# EAGLE board discferret_main (EAGLE 6.6.0)
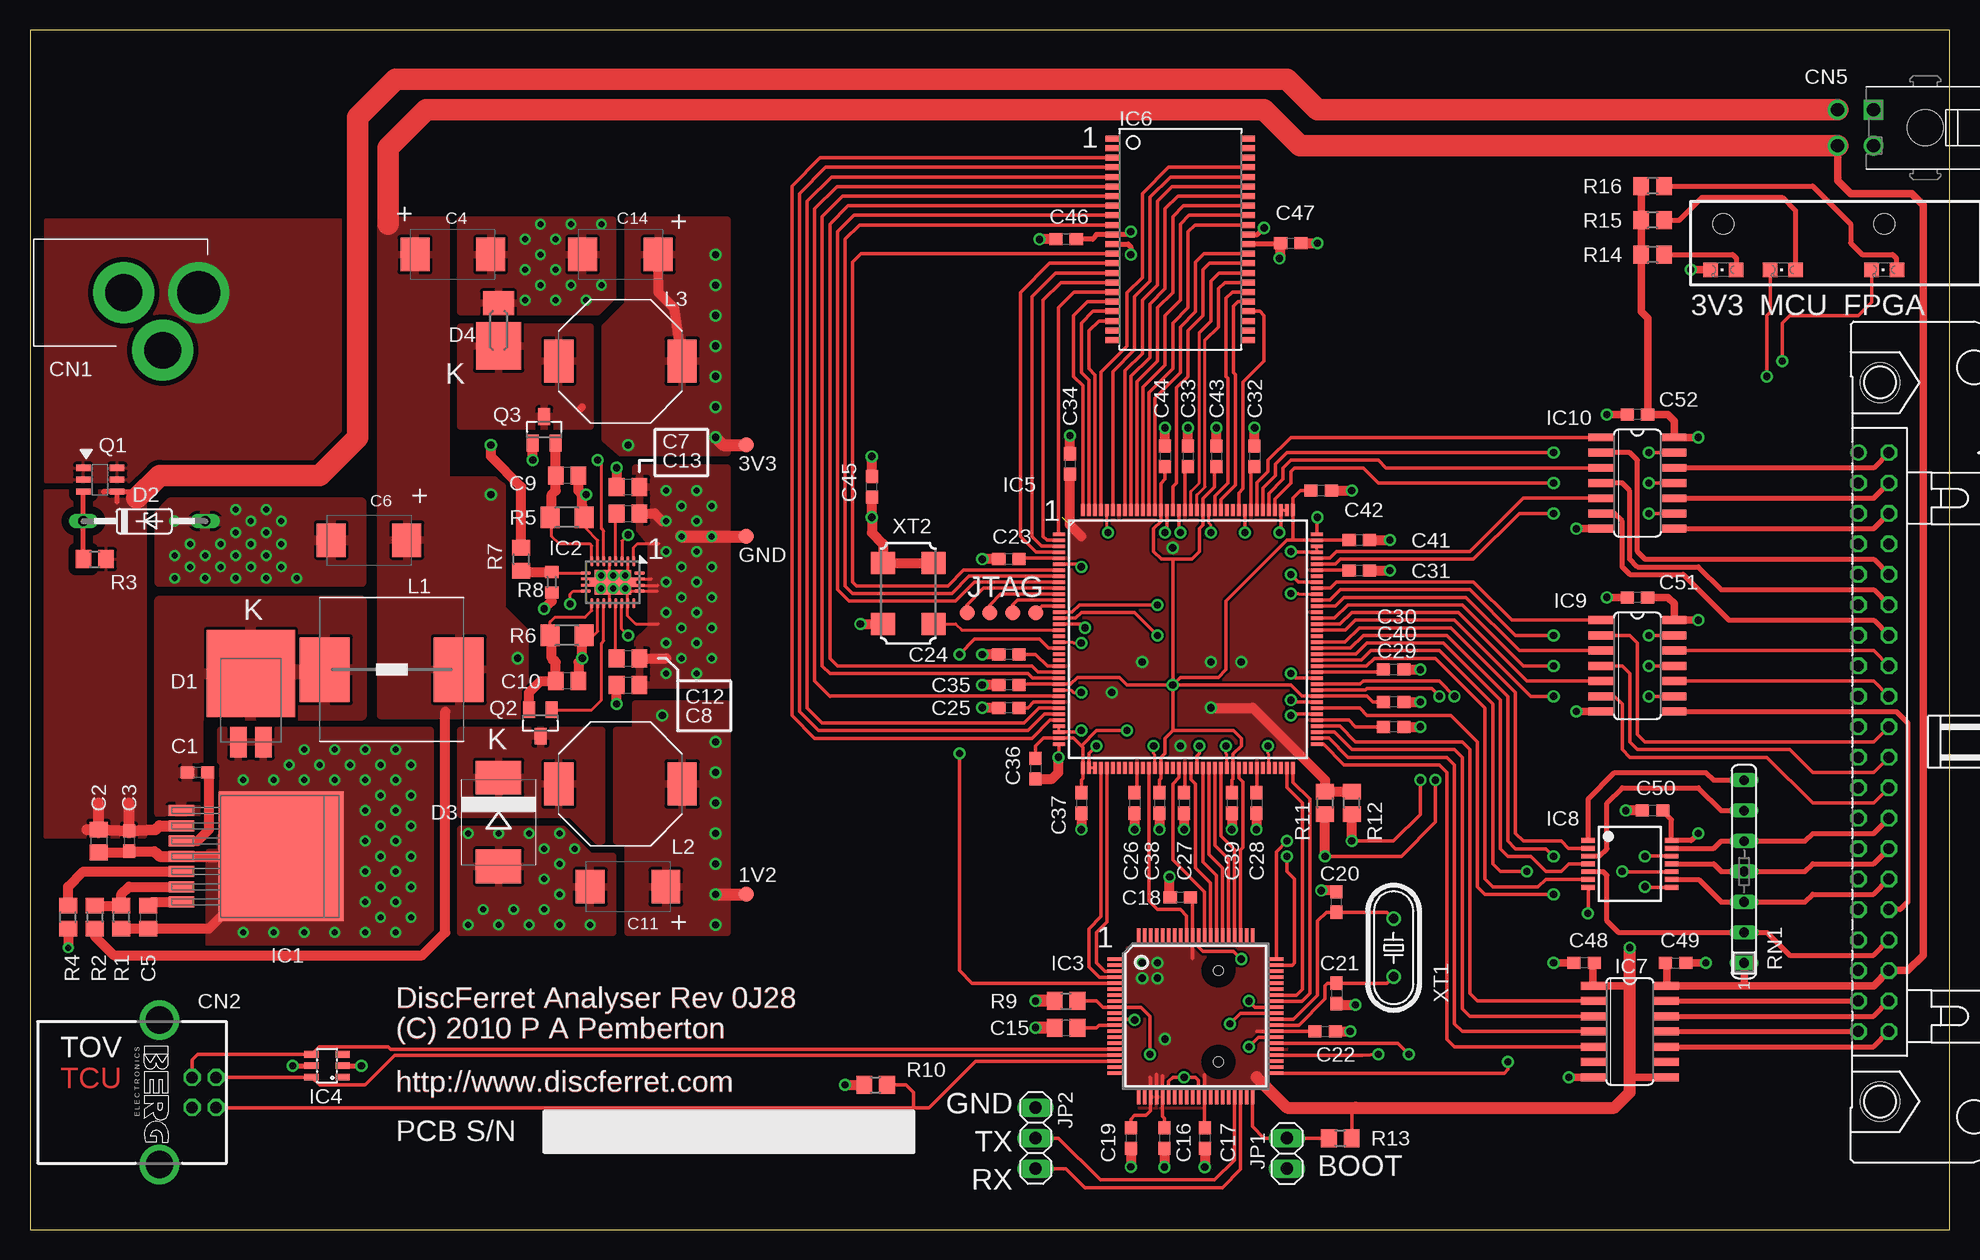
[diagram p8: board, top side]
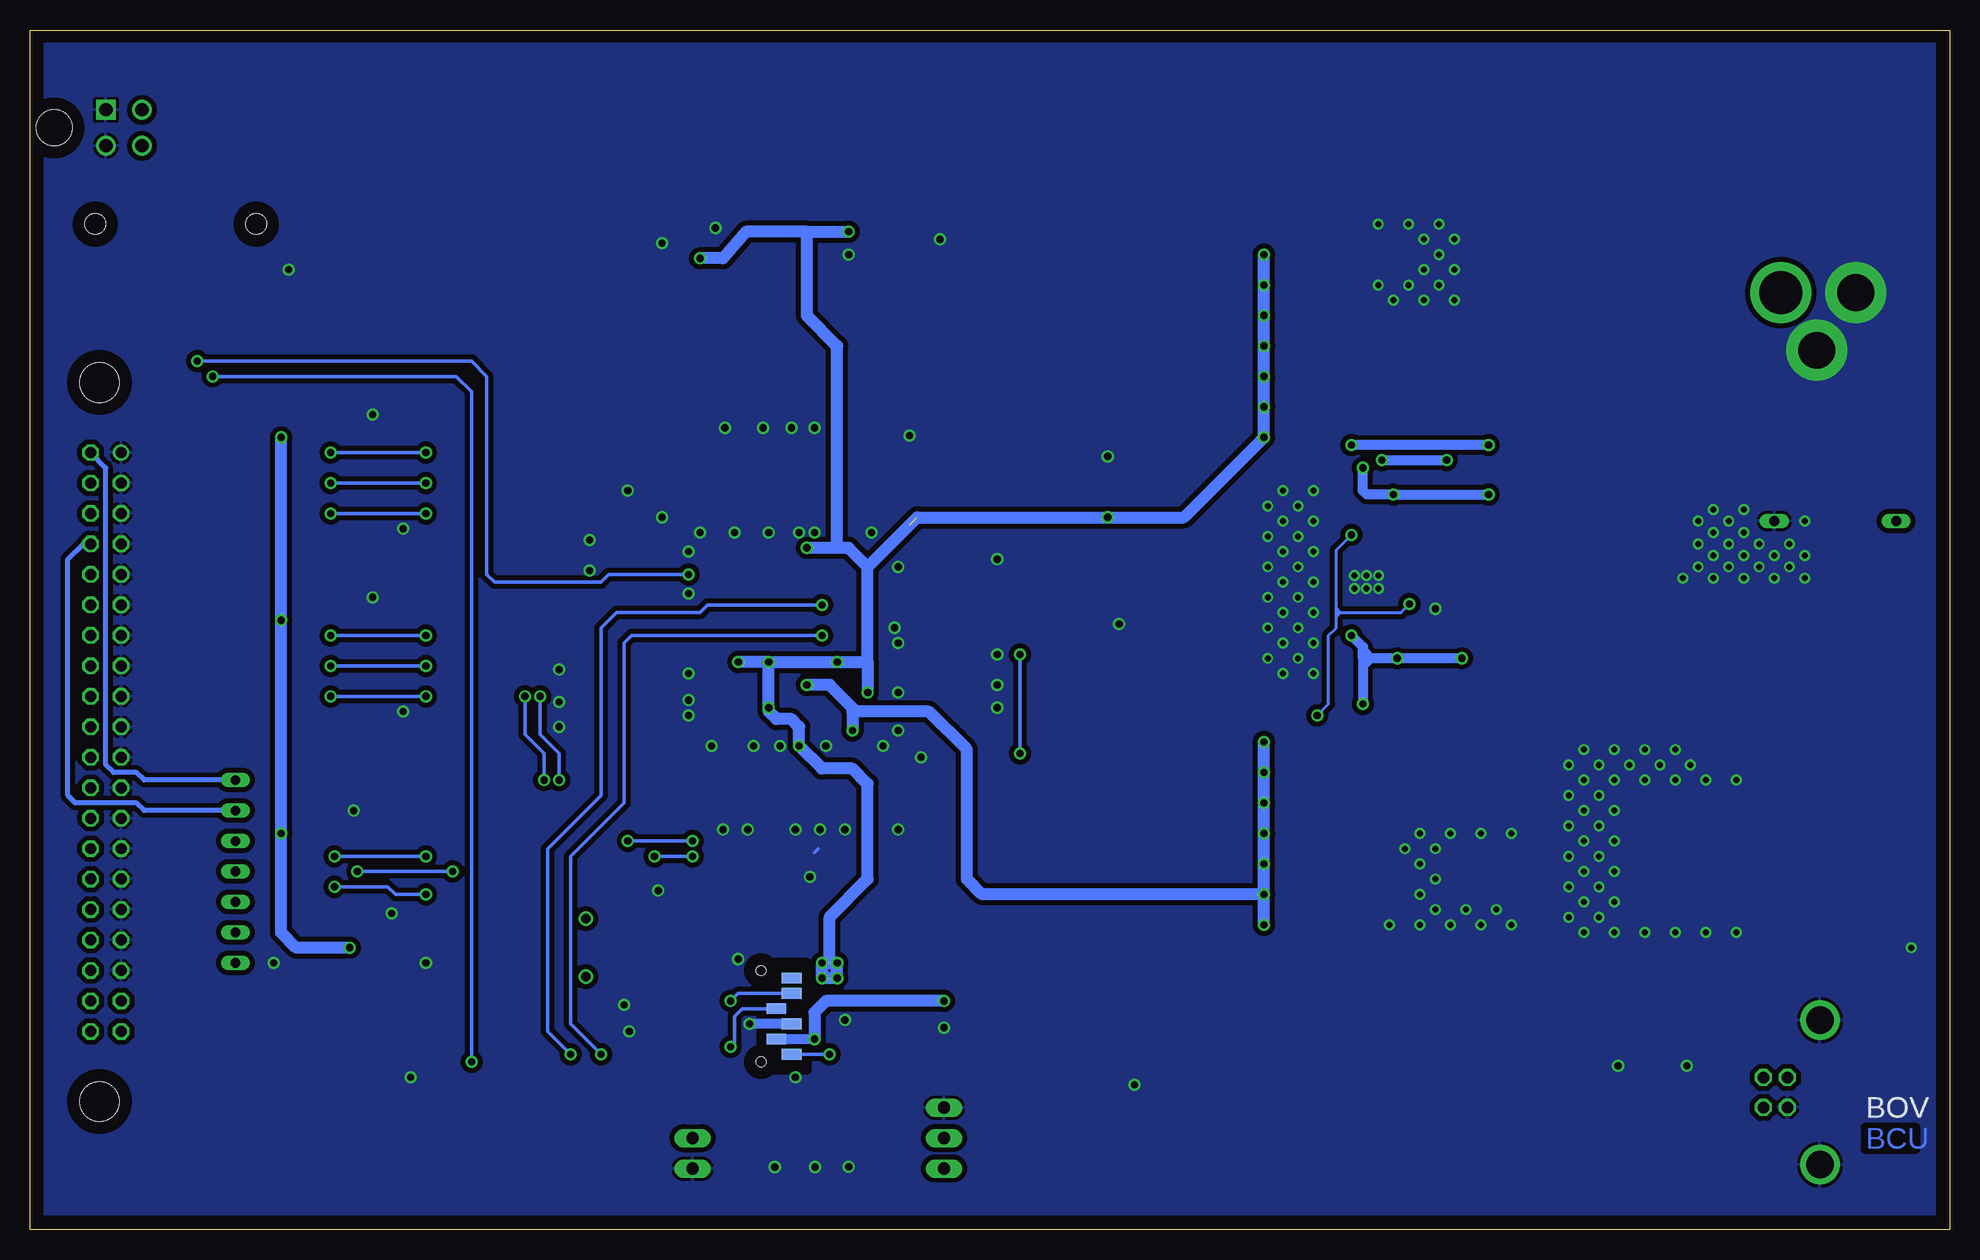
[diagram p9: board, bottom side, seen from below]

Size 160 x 100 mm. Coordinates in mm from the lower left corner, seen from the top.
Outline: 0,0 160,0 160,100 0,100 0,0
Copper layers (1*16): Top 0.035mm / dielectric 1.5mm / Bottom 0.035mm
Design rules "default *": minimum track width 6mil, minimum drill 12mil, track to track 7mil, track to pad 7mil, pad to pad 7mil, via to via 7mil, smd to smd 7mil, copper to edge 40mil, drill to drill 20mil, minimum pad ring 8mil, minimum via ring 8mil, stop-mask expansion 6mil, vias tented up to drill 0mil, thermal gap 10mil
Holes 1.7 mm at 154.56,83.82 141.15,83.82
tKeepout: area 0,97.5 to 160,100; area 0,0 to 160,2.5

## Footprints (pad centres in the part's own frame; a part is rotated, then mirrored left to right if it is on the bottom)
B1,27 = smd 1.27 x 1.27: TP 0,0
C0603 = smd 1.1 x 1: 1 -0.85,0; 2 0.85,0
C0805 = smd 1.3 x 1.5: 1 -0.95,0; 2 0.95,0
SMC_D = smd 2.4 x 2.8: + -3.15,0; - 3.15,0
RAPC722NT = drill 3.048 pad 5.08: BARREL 0,7.493; SW 4.801,10.744 | drill 3.556 pad 5.08: PIN 0,13.741
PN61729-S = drill 0.95 octagon: 1 1.25,4.71; 2 -1.25,4.71; 3 -1.25,2.71; 4 1.25,2.71 | drill 2.3 pad 2.9: S1 -6.02,0; S2 6.02,0
ICSP_SMD = smd 1.651 x 0.889: 1 -0.635,3.175; 2 0.635,1.905; 3 -0.635,0.635; 4 0.635,-0.635; 5 -0.635,-1.905; 6 -0.635,-3.175 | hole 0.8: 1.905,3.81; 1.905,-3.81
40H = drill 0.914: 1 -24.13,-1.27 | drill 0.914 octagon: 2 -24.13,1.27; 3 -21.59,-1.27; 4 -21.59,1.27; 5 -19.05,-1.27; 6 -19.05,1.27; 7 -16.51,-1.27; 8 -16.51,1.27; 9 -13.97,-1.27; 10 -13.97,1.27; 11 -11.43,-1.27; 12 -11.43,1.27; 13 -8.89,-1.27; 14 -8.89,1.27; 15 -6.35,-1.27; 16 -6.35,1.27; 17 -3.81,-1.27; 18 -3.81,1.27; 19 -1.27,-1.27; 20 -1.27,1.27; 21 1.27,-1.27; 22 1.27,1.27; 23 3.81,-1.27; 24 3.81,1.27; 25 6.35,-1.27; 26 6.35,1.27; 27 8.89,-1.27; 28 8.89,1.27; 29 11.43,-1.27; 30 11.43,1.27; 31 13.97,-1.27; 32 13.97,1.27; 33 16.51,-1.27; 34 16.51,1.27; 35 19.05,-1.27; 36 19.05,1.27; 37 21.59,-1.27; 38 21.59,1.27; 39 24.13,-1.27; 40 24.13,1.27 | hole 3.302: -29.972,0.533; 29.972,0.533
3-794618-4 = drill 1.1 square: 1 0,0 | drill 1.1: 2 0,3; 3 -3,0; 4 -3,3 | hole 3: -1.5,-4.32
TO277A_SMPC_LARGEPAD = smd 1.397 x 2.54: 1 1.041,-4.445; 2 -1.041,-4.445 | smd 7.341 x 7.264: K 0,1.27
DO35Z10 = drill 0.813 long: A 5.08,0; C -5.08,0
SMC = smd 2.8 x 3.8: A 3.7,0; C -3.7,0
POWERMITE_LARGEPAD = smd 3.97 x 3.77: 1 -1.27,0 | smd 1.97 x 2.57: 2 2.3,0
TO263-7 = smd 2.159 x 0.914: 1 8.331,-3.81; 2 8.331,-2.54; 3 8.331,-1.27; 4 8.331,0; 5 8.331,1.27; 6 8.331,2.54; 7 8.331,3.81 | smd 10.414 x 10.795: PAD 0,0
R-PQFP-N20 = smd 0.85 x 0.28: 1 -2.235,-0.75; 10 2.235,-0.75; 11 2.235,0.75; 20 -2.235,0.75 | smd 0.28 x 0.85: 2 -1.75,-1.75; 3 -1.25,-1.75; 4 -0.75,-1.75; 5 -0.25,-1.75; 6 0.25,-1.75; 7 0.75,-1.75; 8 1.25,-1.75; 9 1.75,-1.75; 12 1.75,1.75; 13 1.25,1.75; 14 0.75,1.75; 15 0.25,1.75; 16 -0.25,1.75; 17 -0.75,1.75; 18 -1.25,1.75; 19 -1.75,1.75 | smd 3.05 x 2.05: E@1 0,0 | smd 3.85 x 0.5: E@2 0,0 | smd 5.3 x 0.23: E@3 0,0.275; E@4 0,-0.275
TQFP80-12X12 = smd 1.2 x 0.3: 1 -6.725,4.75; 2 -6.725,4.25; 3 -6.725,3.75; 4 -6.725,3.25; 5 -6.725,2.75; 6 -6.725,2.25; 7 -6.725,1.75; 8 -6.725,1.25; 9 -6.725,0.75; 10 -6.725,0.25; 11 -6.725,-0.25; 12 -6.725,-0.75; 13 -6.725,-1.25; 14 -6.725,-1.75; 15 -6.725,-2.25; 16 -6.725,-2.75; 17 -6.725,-3.25; 18 -6.725,-3.75; 19 -6.725,-4.25; 20 -6.725,-4.75; 41 6.725,-4.75; 42 6.725,-4.25; 43 6.725,-3.75; 44 6.725,-3.25; 45 6.725,-2.75; 46 6.725,-2.25; 47 6.725,-1.75; 48 6.725,-1.25; 49 6.725,-0.75; 50 6.725,-0.25; 51 6.725,0.25; 52 6.725,0.75; 53 6.725,1.25; 54 6.725,1.75; 55 6.725,2.25; 56 6.725,2.75; 57 6.725,3.25; 58 6.725,3.75; 59 6.725,4.25; 60 6.725,4.75 | smd 0.3 x 1.2: 21 -4.75,-6.725; 22 -4.25,-6.725; 23 -3.75,-6.725; 24 -3.25,-6.725; 25 -2.75,-6.725; 26 -2.25,-6.725; 27 -1.75,-6.725; 28 -1.25,-6.725; 29 -0.75,-6.725; 30 -0.25,-6.725; 31 0.25,-6.725; 32 0.75,-6.725; 33 1.25,-6.725; 34 1.75,-6.725; 35 2.25,-6.725; 36 2.75,-6.725; 37 3.25,-6.725; 38 3.75,-6.725; 39 4.25,-6.725; 40 4.75,-6.725; 61 4.75,6.725; 62 4.25,6.725; 63 3.75,6.725; 64 3.25,6.725; 65 2.75,6.725; 66 2.25,6.725; 67 1.75,6.725; 68 1.25,6.725; 69 0.75,6.725; 70 0.25,6.725; 71 -0.25,6.725; 72 -0.75,6.725; 73 -1.25,6.725; 74 -1.75,6.725; 75 -2.25,6.725; 76 -2.75,6.725; 77 -3.25,6.725; 78 -3.75,6.725; 79 -4.25,6.725; 80 -4.75,6.725
SOT23-6L = smd 0.55 x 1.2: 1 -0.95,-1.3; 2 0,-1.3; 3 0.95,-1.3; 4 0.95,1.3; 5 0,1.3; 6 -0.95,1.3
TQFP144 = smd 1 x 0.3: 1 -10.75,8.75; 2 -10.75,8.25; 3 -10.75,7.75; 4 -10.75,7.25; 5 -10.75,6.75; 6 -10.75,6.25; 7 -10.75,5.75; 8 -10.75,5.25; 9 -10.75,4.75; 10 -10.75,4.25; 11 -10.75,3.75; 12 -10.75,3.25; 13 -10.75,2.75; 14 -10.75,2.25; 15 -10.75,1.75; 16 -10.75,1.25; 17 -10.75,0.75; 18 -10.75,0.25; 19 -10.75,-0.25; 20 -10.75,-0.75; 21 -10.75,-1.25; 22 -10.75,-1.75; 23 -10.75,-2.25; 24 -10.75,-2.75; 25 -10.75,-3.25; 26 -10.75,-3.75; 27 -10.75,-4.25; 28 -10.75,-4.75; 29 -10.75,-5.25; 30 -10.75,-5.75; 31 -10.75,-6.25; 32 -10.75,-6.75; 33 -10.75,-7.25; 34 -10.75,-7.75; 35 -10.75,-8.25; 36 -10.75,-8.75; 73 10.75,-8.75; 74 10.75,-8.25; 75 10.75,-7.75; 76 10.75,-7.25; 77 10.75,-6.75; 78 10.75,-6.25; 79 10.75,-5.75; 80 10.75,-5.25; 81 10.75,-4.75; 82 10.75,-4.25; 83 10.75,-3.75; 84 10.75,-3.25; 85 10.75,-2.75; 86 10.75,-2.25; 87 10.75,-1.75; 88 10.75,-1.25; 89 10.75,-0.75; 90 10.75,-0.25; 91 10.75,0.25; 92 10.75,0.75; 93 10.75,1.25; 94 10.75,1.75; 95 10.75,2.25; 96 10.75,2.75; 97 10.75,3.25; 98 10.75,3.75; 99 10.75,4.25; 100 10.75,4.75; 101 10.75,5.25; 102 10.75,5.75; 103 10.75,6.25; 104 10.75,6.75; 105 10.75,7.25; 106 10.75,7.75; 107 10.75,8.25; 108 10.75,8.75 | smd 0.3 x 1: 37 -8.75,-10.75; 38 -8.25,-10.75; 39 -7.75,-10.75; 40 -7.25,-10.75; 41 -6.75,-10.75; 42 -6.25,-10.75; 43 -5.75,-10.75; 44 -5.25,-10.75; 45 -4.75,-10.75; 46 -4.25,-10.75; 47 -3.75,-10.75; 48 -3.25,-10.75; 49 -2.75,-10.75; 50 -2.25,-10.75; 51 -1.75,-10.75; 52 -1.25,-10.75; 53 -0.75,-10.75; 54 -0.25,-10.75; 55 0.25,-10.75; 56 0.75,-10.75; 57 1.25,-10.75; 58 1.75,-10.75; 59 2.25,-10.75; 60 2.75,-10.75; 61 3.25,-10.75; 62 3.75,-10.75; 63 4.25,-10.75; 64 4.75,-10.75; 65 5.25,-10.75; 66 5.75,-10.75; 67 6.25,-10.75; 68 6.75,-10.75; 69 7.25,-10.75; 70 7.75,-10.75; 71 8.25,-10.75; 72 8.75,-10.75; 109 8.75,10.75; 110 8.25,10.75; 111 7.75,10.75; 112 7.25,10.75; 113 6.75,10.75; 114 6.25,10.75; 115 5.75,10.75; 116 5.25,10.75; 117 4.75,10.75; 118 4.25,10.75; 119 3.75,10.75; 120 3.25,10.75; 121 2.75,10.75; 122 2.25,10.75; 123 1.75,10.75; 124 1.25,10.75; 125 0.75,10.75; 126 0.25,10.75; 127 -0.25,10.75; 128 -0.75,10.75; 129 -1.25,10.75; 130 -1.75,10.75; 131 -2.25,10.75; 132 -2.75,10.75; 133 -3.25,10.75; 134 -3.75,10.75; 135 -4.25,10.75; 136 -4.75,10.75; 137 -5.25,10.75; 138 -5.75,10.75; 139 -6.25,10.75; 140 -6.75,10.75; 141 -7.25,10.75; 142 -7.75,10.75; 143 -8.25,10.75; 144 -8.75,10.75
TSOPII-Z44 = smd 0.5 x 1.2: 1 -8.4,-5.627; 2 -7.6,-5.627; 3 -6.8,-5.627; 4 -6,-5.627; 5 -5.2,-5.627; 6 -4.4,-5.627; 7 -3.6,-5.627; 8 -2.8,-5.627; 9 -2,-5.627; 10 -1.2,-5.627; 11 -0.4,-5.627; 12 0.4,-5.627; 13 1.2,-5.627; 14 2,-5.627; 15 2.8,-5.627; 16 3.6,-5.627; 17 4.4,-5.627; 18 5.2,-5.627; 19 6,-5.627; 20 6.8,-5.627; 21 7.6,-5.627; 22 8.4,-5.627; 23 8.4,5.627; 24 7.6,5.627; 25 6.8,5.627; 26 6,5.627; 27 5.2,5.627; 28 4.4,5.627; 29 3.6,5.627; 30 2.8,5.627; 31 2,5.627; 32 1.2,5.627; 33 0.4,5.627; 34 -0.4,5.627; 35 -1.2,5.627; 36 -2,5.627; 37 -2.8,5.627; 38 -3.6,5.627; 39 -4.4,5.627; 40 -5.2,5.627; 41 -6,5.627; 42 -6.8,5.627; 43 -7.6,5.627; 44 -8.4,5.627
SO14 = smd 0.66 x 2.032: 1 -3.81,-3.073; 2 -2.54,-3.073; 3 -1.27,-3.073; 4 0,-3.073; 5 1.27,-3.073; 6 2.54,-3.073; 7 3.81,-3.073; 8 3.81,3.073; 9 2.54,3.073; 10 1.27,3.073; 11 0,3.073; 12 -1.27,3.073; 13 -2.54,3.073; 14 -3.81,3.073
SSOP14 = smd 0.4 x 1.1: 1 -1.95,-3.475; 2 -1.3,-3.475; 3 -0.65,-3.475; 4 0,-3.475; 5 0.65,-3.475; 6 1.3,-3.475; 7 1.95,-3.475; 8 1.95,3.475; 9 1.3,3.475; 10 0.65,3.475; 11 0,3.475; 12 -0.65,3.475; 13 -1.3,3.475; 14 -1.95,3.475
1X02 = drill 1.016 long: 1 -1.27,0; 2 1.27,0
1X03 = drill 1.016 long: 1 -2.54,0; 2 0,0; 3 2.54,0
WE-PD_L/LS/XL/XXL = smd 4.17 x 5.4: 1 -5.585,0; 2 5.585,0
WE-TPC_XL/XLH = smd 3.6 x 2.435: 1 0,5.135; 2 0,-5.135
CHIPLED_0805 = smd 1.2 x 1.2: A 0,-1.05; C 0,1.05
TSOP6_VISHAY_LARGEPAD = smd 0.508 x 1.219: 1 0,0; 2 0.991,0; 3 1.981,0; 4 1.981,2.819; 5 0.991,2.819; 6 0,2.819
SOT23 = smd 1 x 1.4: 1 -0.95,-1.1; 2 0.95,-1.1; 3 0,1.1
R0805 = smd 1.3 x 1.5: 1 -0.95,0; 2 0.95,0
R1206 = smd 1.6 x 1.803: 1 -1.422,0; 2 1.422,0
R0603 = smd 1 x 1.1: 1 -0.85,0; 2 0.85,0
SIL7 = drill 0.813 long: 1 -7.62,0; 2 -5.08,0; 3 -2.54,0; 4 0,0; 5 2.54,0; 6 5.08,0; 7 7.62,0
HC49/S = drill 0.813: 1 -2.413,0; 2 2.413,0
CSX750F = smd 1.8 x 2: 1 0,0; 2 5.08,0; 3 5.08,4.2; 4 0,4.2

## Placement (x,y rotation side)
1V2  TPB1,27  [B1,27]  59.69,27.94 0 top
3V3  TPB1,27  [B1,27]  59.69,65.41 0 top
C1  10n  [C0603]  13.97,38.1 180 top
C2  10u  [C0805]  5.71,32.38 270 top
C3  100n  [C0603]  8.26,32.38 270 top
C4  100u 10V  [SMC_D]  35.24,81.28 0 top
C5  2n7  [C0805]  9.84,26.04 270 top
C6  100u  [SMC_D]  28.26,57.47 180 top
C7  100n  [C0805]  49.85,61.91 0 top
C8  100n  [C0805]  49.85,45.4 0 top
C9  10u  [C0805]  44.77,62.87 180 top
C10  10u  [C0805]  44.77,45.72 180 top
C11  100u 10V  [SMC_D]  49.85,28.57 180 top
C12  1n5  [C0805]  49.85,47.62 0 top
C13  1n5  [C0805]  49.85,59.69 0 top
C14  100u 10V  [SMC_D]  49.21,81.28 180 top
C15  10u  [C0805]  86.36,16.83 0 top
C16  100n  [C0603]  94.55,7.62 270 top
C17  100n  [C0603]  97.92,7.62 270 top
C18  100n  [C0603]  95.89,27.69 180 top
C19  100n  [C0603]  91.76,7.62 270 top
C20  12p  [C0603]  108.9,27.3 90 top
C21  12p  [C0603]  108.9,19.68 270 top
C22  100n  [C0603]  107.95,16.51 0 top
C23  10n  [C0603]  81.6,55.88 180 top
C24  10n  [C0603]  81.6,47.94 180 top
C25  10n  [C0603]  81.6,43.5 180 top
C26  10n  [C0603]  92.08,35.56 270 top
C27  10n  [C0603]  96.2,35.56 270 top
C28  10n  [C0603]  102.23,35.56 270 top
C29  10n  [C0603]  113.67,41.91 180 top
C30  10n  [C0603]  113.67,46.67 180 top
C31  10n  [C0603]  110.81,54.93 180 top
C32  10n  [C0603]  102.08,64.45 270 top
C33  10n  [C0603]  96.52,64.45 270 top
C34  10n  [C0603]  86.68,63.82 270 top
C35  10n  [C0603]  81.6,45.4 180 top
C36  10n  [C0603]  83.82,38.42 270 top
C37  10n  [C0603]  87.63,35.56 270 top
C38  10n  [C0603]  94.14,35.56 270 top
C39  10n  [C0603]  100.17,35.56 270 top
C40  10n  [C0603]  113.67,43.97 180 top
C41  10n  [C0603]  110.81,57.47 180 top
C42  10n  [C0603]  107.63,61.59 180 top
C43  10n  [C0603]  98.9,64.45 270 top
C44  10n  [C0603]  94.62,64.45 270 top
C45  10n  [C0603]  70.17,61.91 90 top
C46  10n  [C0603]  86.36,82.55 180 top
C47  10n  [C0603]  105.09,82.23 0 top
C48  10n  [C0603]  129.54,22.23 180 top
C49  10n  [C0603]  137.16,22.23 0 top
C50  10n  [C0603]  135.25,34.92 180 top
C51  10n  [C0603]  133.99,52.7 180 top
C52  10n  [C0603]  133.99,67.94 180 top
CN1  RAPC722  [RAPC722NT]  0.32,78.11 270 top
CN2  PN61729-S  [PN61729-S]  10.79,11.43 270 top
CN3  ICSPSMD  [ICSP_SMD]  97.16,17.78 180 bottom
CN4  [40H]  153.67,40.64 270 top
CN5  2X2-A  [3-794618-4]  153.67,93.34 90 top
D1  SS8P3L-M3/86A  [TO277A_SMPC_LARGEPAD]  18.41,45.09 0 top
D2  BZX55 7V5  [DO35Z10]  9.53,59.05 0 top
D3  SS32  [SMC]  39.05,33.97 270 top
D4  MBRM120LT  [POWERMITE_LARGEPAD]  39.05,74.93 90 top
GND  TPB1,27  [B1,27]  59.69,57.78 0 top
IC1  LM2679S  [TO263-7]  20.95,31.11 180 top
IC2  TPS75003  [R-PQFP-N20]  48.58,53.98 180 top
IC3  PIC18F85J50  [TQFP80-12X12]  97.16,17.78 0 top
IC4  SN65220  [SOT23-6L]  24.77,13.65 90 top
IC5  EP2C8AT144  [TQFP144]  96.52,49.21 0 top
IC6  CY7C1049DV33  [TSOPII-Z44]  95.89,82.55 270 top
IC7  TXB0104D  [SO14]  133.35,16.51 270 top
IC8  SN74LVC14ADB  [SSOP14]  133.35,30.48 270 top
IC9  SN74LVC07AD  [SO14]  133.99,46.99 270 top
IC10  SN74LVC07AD  [SO14]  133.99,62.23 270 top
JP1  BOOT  [1X02]  104.78,6.35 90 top
JP2  UART  [1X03]  83.82,7.62 270 top
L1  10uH  [WE-PD_L/LS/XL/XXL]  30.16,46.67 0 top
L2  15uH  [WE-TPC_XL/XLH]  49.21,37.15 90 top
L3  5uH  [WE-TPC_XL/XLH]  49.21,72.39 90 top
LED1  GRN 0805  [CHIPLED_0805]  141.15,80.01 90 top
LED2  YLW 0805  [CHIPLED_0805]  146.1,80.01 90 top
LED3  YLW 0805  [CHIPLED_0805]  154.56,80.01 90 top
Q1  SI3443CDV  [TSOP6_VISHAY_LARGEPAD]  4.45,63.5 270 top
Q2  SI2323DS-T1-E3  [SOT23]  42.55,42.23 180 top
Q3  SI2323DS-T1-E3  [SOT23]  42.86,66.67 0 top
R1  2k49  [R0805]  7.62,26.04 90 top
R2  7k87  [R0805]  5.4,26.04 270 top
R3  1k5  [R0805]  5.4,55.88 0 top
R4  4k99  [R0805]  3.17,26.04 90 top
R5  0R033  [R1206]  44.77,59.37 0 top
R6  0R033  [R1206]  44.77,49.53 0 top
R7  61k9  [R0805]  40.96,55.88 90 top
R8  36k5  [R0603]  43.5,53.98 90 top
R9  10k  [R0805]  86.36,19.05 0 top
R10  10k  [R0805]  70.48,12.06 0 top
R11  10k  [R0805]  107.95,35.56 90 top
R12  10k  [R0805]  110.17,35.56 90 top
R13  10k  [R0805]  109.22,7.62 0 top
R14  220R  [R0805]  135.25,81.28 180 top
R15  220R  [R0805]  135.25,84.14 180 top
R16  220R  [R0805]  135.25,87 180 top
RN1  1k  [SIL7]  142.88,29.84 90 top
TCK  TPB1,27  [B1,27]  81.92,51.44 0 top
TDI  TPB1,27  [B1,27]  83.82,51.44 0 top
TDO  TPB1,27  [B1,27]  78.11,51.44 0 top
TMS  TPB1,27  [B1,27]  80.01,51.44 0 top
XT1  20MHz  [HC49/S]  113.67,23.5 270 top
XT2  CSX750FBC20.000M-UT  [CSX750F]  71.12,55.56 270 top

## Tracks (layer width: path | path; a pad name or v marks a point on that pad's centre or on a via)
+1V2  (via drill 0.6)
  Top 0.254: v49.85,57.91 49.34,57.4 IC2.4 | IC2.11 45.29,53.23 45.02,52.96 v45.02,52.13
  Top 0.305: 95.25,55.88 94.3,55.88 93.66,56.52 93.66,58.42 94.27,59.03 IC5.131 94.27,62.2 94.61,62.55 94.61,62.97 C44.2 | 95.25,55.88 96.84,55.88 97.47,56.52 97.47,58.42 97.77,58.72 IC5.124 97.77,60.94 98.74,61.91 98.74,62.97 C43.2 | 95.25,41.59 100.33,41.59 100.97,40.96 100.97,40.32 100.27,39.63 IC5.62 100.27,37.56 100.17,37.47 C39.1 | v95.25,45.4 91.44,45.4 90.81,46.04 87.31,46.04 86.74,45.46 IC5.26 83.14,45.46 C35.1 | v95.25,45.4 95.25,41.59 | 95.25,41.59 94.61,40.96 94.61,39.69 94.27,39.34 IC5.50 94.27,37.6 94.14,37.47 C38.1 | v95.25,45.4 105.09,45.4 106.03,44.46 IC5.81 111.45,44.46 111.92,43.97 C40.2 | v95.25,45.4 95.25,55.88 | 105.41,57.46 104.77,57.46 99.69,52.39 99.69,46.67 99.06,46.04 95.89,46.04 v95.25,45.4 | 105.41,57.46 IC5.107 C41.2 | 105.41,57.46 105.27,57.6 IC5.109 105.27,60.98 105.89,61.59 C42.2 | 87.63,40.32 86.99,40.96 IC5.35 84.46,40.96 83.82,40.32 C36.1 | 87.63,40.32 88.9,41.59 v91.44,41.59 | 87.63,40.32 87.77,40.18 IC5.37 87.77,37.6 87.63,37.47 C37.1 | C38.1
  Top 1.016: v57.15,27.94 1V2.TP
  Bottom 0.254: v52.7,42.86 51.75,43.81 51.75,49.53 51.12,50.16 51.12,51.12 | 51.12,51.12 51.12,51.44 | 51.12,51.44 50.8,51.44 | 50.8,51.44 45.72,51.44 v45.02,52.13 | 50.8,51.44 51.12,51.75 | 51.12,51.44 51.12,51.75 | 51.12,51.12 50.8,51.44 | v49.85,57.91 51.12,56.64 51.12,51.75
  Bottom 1.016: v95.25,45.4 93.34,45.4 91.44,43.5 91.44,43.18 | 91.44,43.18 v91.44,41.59 | 91.44,43.18 85.09,43.18 81.92,40.01 81.92,29.21 80.64,27.94 v57.15,27.94 | v57.15,25.4 v57.15,27.94 | v57.15,27.94 v57.15,30.48 v57.15,33.02 v57.15,35.56 v57.15,38.1 v57.15,40.64
  pour Top: 49.85,24.77 49.85,32.38 48.9,32.38 48.9,41.59 50.48,41.59 50.48,43.81 58.1,43.81 58.1,24.77
+3V3  (via drill 0.6)  (1 unrouted)
  Top 0.305: 102.25,16.53 IC3.48 106.34,16.53 C22.1 | 96.91,22.61 IC3.71 96.91,27.52 C18.1 | 94.41,12.81 IC3.25 94.41,9.42 94.55,9.27 C16.1 | 97.91,12.9 IC3.32 97.91,8.48 C17.1 | IC3.24 93.91,12.94 | IC5.5 82.53,55.96 C23.1 | IC5.66 102.27,36.45 C28.1 | IC5.54 96.27,36.48 C27.1 | IC5.46 92.27,36.6 C26.1 | IC5.77 109.94,42.46 110.49,41.91 C29.2 | IC5.102 109.92,54.96 C31.2 | IC5.85 112.5,46.46 112.71,46.67 C30.2 | IC5.116 101.77,63.43 C32.2 | IC5.23 84.8,46.96 83.82,47.94 C24.1 | IC5.29 83.65,43.96 83.19,43.5 C25.1 | C47.1 104.16,82.15 | IC5.127 96.27,63.09 96.52,63.34 C33.2 | 93.34,12.7 93.41,12.64 IC3.23 93.41,9.9 93.03,9.53 92.08,9.53 91.76,9.21 C19.1 | R13.2 110.17,9.84 110.49,10.16
  Top 0.406: C46.1 88.58,82.55 88.88,82.95 IC6.11 91.52,82.95 v91.76,83.19 | 104.16,82.15 IC6.33 | v139.06,33.02 138.47,32.43 IC8.14 136.82,34.17 C50.1
  Top 0.61: 133.35,12.7 IC7.8 | 133.35,20.32 IC7.1 130.28,22.11 C48.1 | C51.1 136.53,52.7 137.06,52.17 IC9.14 v139.06,50.8 | v139.06,66.04 IC10.14 137.06,67.41 136.53,67.94 C52.1 134.84,75.98 134.31,76.52 R14.2 R15.2 R16.2
  Top 0.813: L3.2 53.71,76.78 52.39,78.11 52.39,81.25 C14.+ | R7.2 40.96,61.91 38.42,64.45 v38.42,65.41 | XT2.4 XT2.1 71.12,57.15 70.17,58.1 v70.17,59.37 C45.1 | v98.42,43.5 101.92,43.5 107.95,37.47 R11.2 R12.2 | C47.1 104.24,81.18 v104.14,80.96 | C34.2 86.68,58.74 87.63,57.78
  Top 1.016: R9.1 v83.82,19.05 | 3V3.TP 57.78,65.41 v57.15,66.04 | 102.23,12.7 104.78,10.16 110.49,10.16 132.08,10.16 133.35,11.43 133.35,12.7 133.35,20.32 v133.35,23.5
  Bottom 0.406: 95.25,83.19 95.25,80.64
  Bottom 0.813: v38.42,65.41 v49.85,65.41 | v94.61,15.88 CN3.2
  Bottom 1.016: v83.82,19.05 93.66,19.05 94.61,18.1 v94.61,15.88 | v98.42,47.31 v98.42,43.5 98.42,43.18 97.79,42.55 96.52,42.55 95.89,41.91 v95.89,40.32 93.98,38.42 91.44,38.42 90.17,37.15 90.17,29.21 93.34,26.04 93.34,22.23 v93.98,22.23 | v98.42,47.31 v92.71,47.31 90.17,47.31 | v98.42,47.31 v100.97,47.31 | v57.15,81.28 v57.15,78.74 v57.15,76.2 v57.15,73.66 v57.15,71.12 v57.15,68.58 v57.15,66.04 63.82,59.37 v70.17,59.37 86.04,59.37 90.17,55.24 | v93.98,22.23 v93.98,20.95 v92.71,20.95 v92.71,22.23 v93.98,22.23 | 90.17,47.31 90.17,55.24 | 90.17,47.31 v90.17,44.77 | 92.71,56.83 91.76,56.83 90.17,55.24 | 92.71,56.83 v95.25,56.83 | 95.25,83.19 95.25,76.2 92.71,73.66 92.71,56.83 | 95.25,83.19 v91.76,83.19 | 95.25,83.19 100.33,83.19 102.23,80.96 v104.14,80.96 | v133.35,23.5 137.79,23.5 139.06,24.77 v139.06,33.02 v139.06,50.8 v139.06,66.04
  pour Top: 58.1,64.77 58.1,84.14 49.85,84.14 49.85,77.15 47.94,75.25 47.94,65.91 49.21,64.77
  pour Top (rank 6): 91.44,22.54 89.53,22.54 89.53,13.02 91.44,13.02 91.44,12.06 92.39,12.06 92.39,10.16 101.92,10.16 101.92,12.06 102.87,12.06 102.87,13.02 104.78,13.02 104.78,22.54 102.87,22.54 102.87,23.5 101.92,23.5 101.92,25.4 92.39,25.4 92.39,23.5 91.44,23.5
  pour Top (rank 6): 85.09,58.1 85.09,40.32 86.68,40.32 86.68,39.37 87.63,39.37 87.63,38.1 105.41,38.1 105.41,39.37 106.36,39.37 106.36,40.32 107.63,40.32 107.63,58.1 106.36,58.1 106.36,59.05 105.41,59.05 105.41,60.33 87.63,60.33 87.63,59.05 86.68,59.05 86.68,58.1
  pour Bottom: 92.71,22.23 92.71,20.95 93.98,20.95 93.98,22.23
+5V  (via drill 0.6)
  Top 0.254: IC2.17 49.33,50.05 v49.85,49.53 | R6.2 46.99,49.53 47.33,49.87 IC2.13 | IC2.8 47.33,57.45 46.35,58.42 46.35,59.52 R5.2
  Top 0.61: 142.88,20.32 153.67,20.32 CN4.36 156.53,21.59 157.8,22.86 157.8,85.41 156.84,86.36 151.76,86.36 150.67,87.45 CN5.4 | 142.88,20.32 IC7.14 136.42,22.11 C49.1 | 142.88,20.32 RN1.1
  Top 0.813: R6.2 46.04,49.53 v46.04,47.62 45.72,47.3 C10.1 | R5.2 46.19,59.85 46.04,60.33 46.04,60.96 | C9.1 45.72,61.6 46.04,61.28 46.04,60.96 | 46.04,60.96 v46.35,61.28 | C8.1 48.9,44.77 48.9,44.13 v48.9,43.81 | C7.1 v48.9,63.5 | 34.61,43.18 34.61,24.77 32.7,22.86 6.99,22.86 5.4,24.45 R2.2
  Top 1.778: 29.84,83.82 29.84,90.17 33.02,93.34 102.87,93.34 105.87,90.34 CN5.4
  Bottom 0.813: v40.64,47.62 v46.04,47.62 48.26,47.62 | v38.42,61.28 v46.35,61.28 48.58,61.28 48.9,61.59 v48.9,63.5 | v49.85,49.53 48.9,48.58 48.9,48.26 | 48.9,46.99 v48.9,43.81 | 48.9,47.62 48.9,46.99 | 48.9,47.62 48.9,48.26 | 48.26,47.62 48.9,47.62 | 48.26,47.62 48.9,46.99 | 48.26,47.62 48.9,48.26
  pour Top: 41.27,42.86 41.27,49.85 39.37,51.75 39.37,61.98 38.73,62.48 34.67,62.48 34.67,84.14 29.21,84.14 29.21,42.86
+12V
  Top 0.406: Q1.4 8.97,61.52 | Q1.4 6.11,61.52 | 7.26,60.68 Q1.4
  Top 0.914: IC1.2 10.79,33.66 10.47,33.34 C3.1 C2.1 | 5.71,33.66 5.71,35.56 | 8.26,33.66 8.26,35.56 | 4.76,33.34 6.35,33.34
  Top 1.778: 8.89,60.96 10.79,62.87 24.13,62.87 27.3,66.04 27.3,92.71 30.48,95.89 104.78,95.89 107.31,93.34 CN5.2
  pour Top (isolate 0.406): 9.59,32.7 1.27,32.7 1.27,53.34 9.59,53.34
  pour Top (isolate 0.61): 9.59,53.02 1.27,53.02 1.27,61.59 9.59,61.59
FCDATA0  (via drill 0.6)
  Top 0.305: IC5.14 86.86,51.46 87.47,52.07 v93.98,52.07 | IC3.46 114.01,15.53 v114.94,14.61
  Bottom 0.305: v93.98,52.07 103.5,52.07 104.14,51.44 111.12,51.44 112.39,50.16 112.39,36.2 116.84,31.75 116.84,16.51 v114.94,14.61
FCDCLK  (via drill 0.6)
  Top 0.305: IC5.15 87.16,50.96 87.63,51.44 92.08,51.44 v93.98,49.53 | IC3.44 111.05,14.53 v112.39,14.61
  Bottom 0.305: v93.98,49.53 109.86,49.53 110.49,48.9 110.49,35.56 114.94,31.11 114.94,17.14 v112.39,14.61
FCDONE  (via drill 0.6)
  Top 0.305: IC5.83 110.87,45.46 111.12,45.72 117.47,45.72 v118.75,44.45 | IC3.59 105.22,22.03 105.41,22.23 105.41,29.21 104.78,29.84 v104.78,31.11 | v107.95,31.11 114.3,31.11 117.16,33.97 v117.16,37.47
  Top 0.813: v107.95,31.11 R11.1
  Bottom 0.305: v104.78,31.11 v107.95,31.11 | v117.16,37.47 117.16,39.69 118.75,41.27 v118.75,44.45
FCNCONF  (via drill 0.6)
  Top 0.305: IC5.20 84.89,48.46 84.14,49.21 78.74,49.21 v77.47,47.94 | IC3.5 78.53,20.53 77.47,21.59 v77.47,39.69
  Bottom 0.305: v77.47,39.69 v77.47,47.94
FCNSTAT  (via drill 0.6)
  Top 0.305: IC3.60 103.88,31.49 v104.78,32.38 | v110.17,32.38 113.67,32.38 115.89,34.61 v115.89,37.47 | IC5.82 111.32,44.96 111.44,45.09 116.84,45.09 v117.47,44.45
  Top 0.813: v110.17,32.38 R12.1
  Bottom 0.305: v104.78,32.38 v110.17,32.38 | v115.89,37.47 115.89,39.69 117.47,41.27 v117.47,44.45
FD_DENSITY
  Top 0.406: RN1.7 140.34,37.47 139.7,38.1 132.08,38.1 129.88,35.9 IC8.1 | IC10.12 153.67,63.5 CN4.2
  Bottom 0.406: CN4.2 153.67,63.5 153.67,38.73 153.03,38.1 151.13,38.1 150.5,37.47 RN1.7
FD_DS0
  Top 0.406: IC10.2 133.35,64.77 133.99,64.14 133.99,56.52 134.62,55.88 153.67,55.88 CN4.10
FD_DS1
  Top 0.406: IC10.4 132.72,62.23 133.35,61.59 133.35,55.88 133.99,55.24 139.06,55.24 140.97,53.34 153.67,53.34 CN4.12
FD_DS2
  Top 0.406: IC10.6 132.08,59.69 132.72,59.05 132.72,55.24 133.35,54.61 137.79,54.61 141.6,50.8 153.67,50.8 CN4.14
FD_DS3
  Top 0.406: IC10.8 153.67,58.42 CN4.6
FD_IN_USE
  Top 0.406: IC10.10 153.67,60.96 CN4.4
FD_INDEX
  Top 0.406: RN1.6 140.97,34.92 139.06,36.83 132.72,36.83 131.44,35.56 131.44,31.75 130.82,31.13 IC8.3
  Bottom 0.406: CN4.8 155.57,57.15 156.84,55.88 156.84,36.2 156.21,35.56 151.13,35.56 150.5,34.92 RN1.6
FD_MOTEN
  Top 0.305: IC9.12 153.67,48.26 CN4.16
FD_RD_DATA
  Top 0.406: CN4.30 153.67,27.94 148.59,27.94 147.96,27.3 RN1.3 140.97,27.3 139.09,29.18 IC8.9
FD_RY_DCHG
  Top 0.406: CN4.34 153.67,22.86 146.69,22.86 144.78,24.77 RN1.2 132.4,24.77 131.44,25.72 131.44,29.53 131.14,29.83 IC8.5
FD_SIDESEL
  Top 0.406: IC9.8 155.57,43.18 156.53,42.23 156.53,27.3 155.89,26.67 CN4.32
FD_STEP
  Top 0.305: CN4.20 153.67,40.64 134.62,40.64 133.99,41.27 133.99,48.9 133.35,49.53 IC9.2
FD_STEPDIR
  Top 0.305: IC9.10 153.67,45.72 CN4.18
FD_TRACK0
  Top 0.406: CN4.26 153.67,33.02 148.59,33.02 147.96,32.38 RN1.5 140.97,32.38 140.37,31.78 IC8.13
FD_WR_PROT
  Top 0.406: CN4.28 153.67,30.48 148.59,30.48 147.96,29.84 RN1.4 140.97,29.84 140.34,30.48 IC8.11
FD_WRDATA
  Top 0.305: IC9.4 132.72,46.99 133.35,46.35 133.35,40.64 133.99,40.01 146.69,40.01 148.59,38.1 153.67,38.1 CN4.22
FD_WRGATE
  Top 0.305: IC9.6 132.08,44.45 132.72,43.81 132.72,40.01 133.35,39.37 144.78,39.37 148.59,35.56 153.67,35.56 CN4.24
FI_DENSITY
  Top 0.305: IC8.2 128.24,31.78 127.64,32.38 124.46,32.38 123.83,33.02 123.83,44.77 118.43,50.16 110.81,50.16 109.61,48.96 IC5.90
FI_INDEX
  Top 0.305: IC8.4 128.27,30.48 127.64,29.84 126.36,29.84 125.09,31.11 123.19,31.11 122.56,31.75 122.56,44.13 117.79,48.9 111.44,48.9 110.51,47.96 IC5.88
FI_RDDAT  (via drill 0.6)
  Top 0.305: 134.66,28.53 IC8.8 | v127,27.94 121.28,27.94 120.65,28.57 120.65,40.64 118.43,42.86 111.44,42.86 110.84,43.46 IC5.79
  Top 0.406: v134.62,28.57 134.66,28.53
  Bottom 0.305: v134.62,28.57 130.18,28.57 129.54,27.94 v127,27.94
FI_RY_CHG
  Top 0.305: IC5.86 111.42,46.96 112.08,47.62 117.16,47.62 121.28,43.5 121.28,29.21 121.95,28.55 125.7,28.55 126.33,29.18 IC8.6
FI_TRACK0  (via drill 0.6)
  Top 0.305: IC8.12 134.63,31.13 v134.62,31.11 | v127,31.11 126.36,31.75 123.83,31.75 123.19,32.38 123.19,44.45 118.11,49.53 111.12,49.53 110.06,48.46 IC5.89
  Bottom 0.305: v127,31.11 v134.62,31.11
FI_WRPROT  (via drill 0.6)
  Top 0.305: IC8.10 v132.73,29.83 v132.72,29.84 | v124.78,29.84 122.56,29.84 121.92,30.48 121.92,43.81 117.47,48.26 111.76,48.26 110.96,47.46 IC5.87
  Bottom 0.305: v124.78,29.84 v132.72,29.84
FO_DENSITY  (via drill 0.6)
  Top 0.305: IC5.114 102.77,61.81 103.82,62.87 103.82,63.82 104.78,64.77 v127,64.77 | v134.94,64.77 IC10.13
  Bottom 0.305: v127,64.77 v134.94,64.77
FO_DS0
  Top 0.305: IC5.115 102.27,62.27 103.19,63.18 103.19,64.14 105.09,66.04 IC10.1
FO_DS1
  Top 0.305: IC5.113 103.27,61.36 104.46,62.55 104.46,63.5 105.09,64.14 112.39,64.14 113.03,63.5 IC10.3
FO_DS2
  Top 0.305: IC5.104 108.35,55.96 108.9,56.52 120.02,56.52 124.46,60.96 IC10.5
FO_DS3  (via drill 0.6)
  Top 0.305: IC5.103 108.8,55.46 109.22,55.88 120.33,55.88 124.14,59.69 v127,59.69 | v134.94,59.69 IC10.9
  Bottom 0.305: v127,59.69 v134.94,59.69
FO_IN_USE  (via drill 0.6)
  Top 0.305: IC5.112 103.77,60.91 105.09,62.23 105.09,63.18 105.41,63.5 111.12,63.5 112.39,62.23 v127,62.23 | v134.94,62.23 IC10.11
  Bottom 0.305: v127,62.23 v134.94,62.23
FO_MOTEN  (via drill 0.6)
  Top 0.305: IC5.97 108.34,52.46 109.22,53.34 120.02,53.34 123.83,49.53 v127,49.53 | v134.94,49.53 IC9.13
  Bottom 0.305: v127,49.53 v134.94,49.53
FO_SIDESEL  (via drill 0.6)
  Top 0.305: IC5.92 109.65,49.96 110.49,50.8 118.75,50.8 125.09,44.45 v127,44.45 | v134.94,44.45 IC9.9
  Bottom 0.305: v127,44.45 v134.94,44.45
FO_STEP
  Top 0.305: IC5.99 108.39,53.46 108.9,53.98 120.33,53.98 123.51,50.8 IC9.1
FO_STEPDIR  (via drill 0.6)
  Top 0.305: IC5.94 108.75,50.96 109.86,52.07 119.38,52.07 124.46,46.99 v127,46.99 | v134.94,46.99 IC9.11
  Bottom 0.305: v127,46.99 v134.94,46.99
FO_WRDATA
  Top 0.305: IC5.96 108.8,51.96 109.54,52.7 119.7,52.7 124.14,48.26 IC9.3
FO_WRGATE
  Top 0.305: IC5.93 109.2,50.46 110.17,51.44 119.06,51.44 124.78,45.72 IC9.5
FPGA20MHZ
  Top 0.254: IC5.17 77.67,49.96 77.15,50.48 XT2.3
FPGALED  (via drill 0.6)
  Top 0.305: IC5.100 105.74,53.96 v105.09,54.61 | LED3.C 153.51,77.31 152.4,76.2 146.69,76.2 146.05,75.56 v146.05,72.39
  Bottom 0.305: v105.09,54.61 111.76,54.61 112.39,53.98 121.28,53.98 121.92,54.61 121.92,71.12 123.19,72.39 v146.05,72.39
GND  (via drill 0.5, 0.6)
  Top 0.254: IC2.E@1 48.33,54.23 | 52.27,53.23 IC2.20 49.96,53.23 49.85,53.34 49.83,53.32 IC2.18 49.83,51.14 50.48,50.48 52.38,50.48 | 51.8,54.25 IC2.E@4 48.55,54.23 48.33,54.23 | IC2.15 48.33,53.45 IC2.E@3 52.34,53.7 | 48.33,54.23 IC2.6 | IC2.3 49.83,54.84 49.34,54.36 | IC2.2 50.33,56.87 50.65,57.19 52.42,57.19 | IC5.140 89.77,58.5 89.85,58.42 v89.85,58.1 | IC5.19 86.93,48.96 87,48.9 v87.63,48.9 | IC5.27 86.8,44.96 87,44.77 v87.63,44.77 | IC5.34 IC5.33 | IC5.49 93.77,39.58 93.66,39.69 v93.66,40.32 | IC5.61 99.77,39.61 99.69,39.69 v99.69,40.32 | IC5.68 103.27,39.6 103.19,39.69 v103.19,40.32 | IC5.111 IC5.110 | IC5.105 IC5.106 | IC5.123 98.27,58.9 98.42,58.74 v98.42,58.1 | IC5.98 105.79,52.96 105.73,53.02 v105.09,53.02 | IC5.39 IC5.38
  Top 0.305: IC3.26 94.91,12.36 95.25,12.7 v96.2,12.7 97.16,12.7 97.41,12.45 IC3.31 | IC3.51 100.9,18.03 v100.01,17.14 | IC3.11 92.01,17.53 v92.08,17.46 | IC3.70 97.41,23.56 97.79,23.18 100.33,23.18 v100.97,22.54 | IC5.6 87.41,55.46 v87.63,55.24 | IC5.130 94.77,58.26 v94.61,58.1 | IC5.128 95.77,58.22 v95.89,58.1 | IC5.105 105.36,56.46 v105.09,56.52 | IC5.117 101.27,58.12 v101.28,58.1 | IC5.111 104.27,58.23 v104.14,58.1 | IC5.78 105.19,42.96 v105.09,42.86 | IC5.80 105.26,43.96 v105.09,44.13 | IC5.38 88.27,39.69 v88.9,40.32 | IC5.34 87.5,41.46 v87.63,41.59 | IC5.36 85.77,39.41 v85.72,39.37 | IC5.108 107.27,59.33 v107.31,59.37 | IC5.84 105.48,45.96 v105.09,46.35 | IC5.16 87.61,50.46 v87.95,50.16 | IC5.56 97.27,39.48 97.47,39.69 v97.47,40.32 | IC8.7 129.88,26.37 v129.86,26.35
  Top 0.406: IC6.34 102.32,82.95 v102.87,83.5 | IC6.12 91.52,82.15 91.76,81.92 v91.76,81.28 | v21.91,13.65 IC4.5 | IC4.2 v27.62,13.65
  Top 0.61: v128.27,12.7 IC7.7 | C48.2 v127,22.23 | C49.2 v139.7,22.23 | v128.91,43.18 IC9.7 | v131.44,52.7 C51.2 | v128.91,58.42 IC10.7 | v131.44,67.94 C52.2 | v138.43,80.01 LED1.C
  Top 0.813: C12.2 53.02,47.62 | C13.2 52.07,59.69 52.7,59.05 v53.02,59.05 | v49.62,54.51 49.06,54.46 IC2.E@1 48.96,53.98 49.34,54.36 | IC1.4 12.06,31.11 | R1.1 C5.2 14.92,25.09 16.51,26.67 | R4.1 v3.17,23.5 | C22.2 v110.05,16.51 | C16.2 v94.55,5.21 | C17.2 v97.92,5.21 | R8.1 43.5,52.39 v42.86,51.75 | v95,29.4 95,27.73 C18.2 | C23.2 v79.38,55.88 | C28.2 v102.23,33.34 | C27.2 v96.2,33.34 | C26.2 v92.08,33.34 | C29.1 v115.89,41.91 | C31.1 v113.35,54.93 | C30.1 v115.89,46.67 | C34.1 v86.68,66.2 | C32.1 v102.08,66.83 | C35.2 v79.38,45.4 | C36.2 85.19,37.57 85.72,38.1 v85.72,39.37 | C24.2 v79.38,47.94 | C25.2 v79.38,43.5 | C38.2 v94.14,33.34 | C39.2 v100.17,33.34 | C40.1 v115.89,43.97 | C43.1 v98.9,66.83 | C37.2 v87.63,33.34 | C41.1 v113.35,57.47 | v69.22,50.48 XT2.2 | C45.2 v70.17,64.45 | C46.2 v84.14,82.55 | C47.2 v107.31,82.23 | C33.1 v96.52,66.83 | C44.1 v94.61,66.83 | C19.2 v91.76,5.24 | v67.94,12.06 R10.1 | v107.63,28.26 108.8,28.26 C20.2 | v110.49,18.73 109.32,18.73 C21.2 | C50.2 v133.03,34.92 | C42.1 v110.17,61.59 | C2.2 8.15,31.43 C3.2 10.38,31.54 10.47,31.43
  Top 0.914: 16.51,31.11 IC1.4 10.79,31.11 10.47,31.43
  Top 1.016: C15.1 v83.82,16.83 | v54.29,57.78 v56.83,57.78 GND.TP
  Bottom 0.305: 94.3,31.75 94.61,31.43
  Bottom 0.813: CN3.3 v100.01,17.14
  other vias: 42.86,26.67 36.51,33.02 42.86,31.75 44.13,25.4 44.13,33.02 41.59,33.02 54.29,50.16 55.56,51.44 53.02,46.35 55.56,48.9 55.56,46.35 54.29,55.24 53.02,56.52 55.56,56.52 27.94,34.92 30.48,34.92 30.48,32.38 27.94,32.38 53.02,48.9 53.02,61.59 55.56,61.59 54.29,47.62 54.29,60.33 53.02,53.98 54.29,52.7 55.56,59.05 53.02,51.44 55.56,53.98 46.67,25.4 37.78,26.67 41.59,25.4 39.05,33.02 36.51,25.4 39.05,25.4 40.32,26.67 47.59,53.44 47.59,54.51 48.6,53.44 48.6,54.51 49.62,53.44 31.75,36.2 29.21,36.2 27.94,29.84 29.21,28.57 27.94,27.3 29.21,26.04 27.94,24.77 31.75,28.57 30.48,27.3 31.75,26.04 30.48,24.77 25.4,24.77 22.86,24.77 20.32,24.77 17.78,24.77 42.55,83.82 45.09,83.82 47.62,83.82 41.27,82.55 43.81,82.55 42.55,81.28 41.27,80.01 42.55,78.74 43.81,80.01 41.27,77.47 43.81,77.47 45.09,78.74 46.35,77.47 47.62,78.74 27.94,37.47 29.21,38.73 26.67,38.73 31.75,38.73 30.48,37.47 25.4,37.47 24.13,38.73 22.86,37.47 21.59,38.73 20.32,37.47 17.78,37.47 30.48,40.01 27.94,40.01 25.4,40.01 22.86,40.01 19.68,54.29 18.41,55.24 17.14,54.29 15.88,55.24 14.61,54.29 13.34,55.24 12.06,54.29 19.68,56.2 17.14,56.2 14.61,56.2 12.06,56.2 12.06,59.05 13.34,57.15 15.88,57.15 18.41,59.05 18.41,57.15 19.68,58.1 20.95,57.15 20.95,59.05 20.95,55.24 22.23,54.29 17.14,58.1 19.68,60.01 29.21,33.66 31.75,33.66 30.48,29.84 31.75,31.11 29.21,31.11 42.86,29.21 45.4,31.75 44.13,30.48 44.13,27.94 17.14,60.01 56.83,60.33 56.83,55.24 56.83,52.7 56.83,50.16 56.83,47.62
  pour Bottom (isolate 0.406, rank 6): 1.27,99.06 1.27,1.27 158.75,1.27 158.75,99.06
  pour Top: 50.48,45.4 50.48,48.9 51.75,50.16 51.75,57.15 50.48,58.74 50.48,63.5 58.1,63.5 58.1,45.4
  pour Top: 48.58,24.77 48.58,31.11 46.67,31.11 44.45,33.34 35.88,33.34 35.88,24.77
  pour Top: 35.88,76.52 47.31,76.52 48.58,77.79 48.58,84.14 35.88,84.14
  pour Top (isolate 0.406): 14.92,23.5 33.34,23.5 33.34,41.59 15.88,41.59 15.88,31.43 14.92,31.43
  pour Top (isolate 0.61): 11.75,60.64 27.62,60.64 27.62,53.98 10.79,53.98 10.79,59.69
HSB1_3V
  Top 0.305: IC5.76 109.17,41.96 110.49,40.64 119.38,40.64 120.02,40.01 120.02,19.68 120.65,19.05 IC7.2
HSB1_5V
  Top 0.406: IC7.13 CN4.37
HSB2_3V
  Top 0.305: IC5.75 108.72,41.46 110.17,40.01 118.75,40.01 119.38,39.37 119.38,18.41 120.02,17.78 IC7.3
HSB2_5V
  Top 0.406: IC7.12 153.67,17.78 CN4.38
HSB3_3V
  Top 0.305: IC5.74 108.26,40.96 109.86,39.37 118.11,39.37 118.75,38.73 118.75,17.14 119.38,16.51 IC7.4
HSB3_5V
  Top 0.406: IC7.11 CN4.39
HSB4_3V
  Top 0.305: IC5.73 107.81,40.46 109.54,38.73 117.47,38.73 118.11,38.1 118.11,15.88 118.75,15.24 IC7.5
HSB4_5V
  Top 0.406: IC7.10 153.67,15.24 CN4.40
ICSP_MCLR  (via drill 0.6)
  Top 0.305: R9.2 88.9,19.05 89.42,18.53 IC3.9 92.59,18.53 93.34,17.78 v93.34,14.61
  Bottom 0.305: v93.34,14.61 CN3.1
ICSP_RB6_PGC  (via drill 0.6)
  Top 0.305: IC3.52 102.12,18.53 v101.6,19.05
  Bottom 0.305: CN3.5 100.97,19.68 v101.6,19.05
ICSP_RB7_PGD  (via drill 0.6)
  Top 0.305: IC3.47 102.39,16.03 v101.6,15.24
  Bottom 0.305: CN3.4 100.65,18.41 101.28,17.78 101.28,15.56 v101.6,15.24
MCULED  (via drill 0.6)
  Top 0.305: IC3.41 122.89,13.03 123.19,13.34 v123.19,13.97 | LED2.C 145.05,76.47 144.78,76.2 v144.78,71.12
  Bottom 0.305: v123.19,13.97 123.19,69.85 124.46,71.12 v144.78,71.12
N$1
  Top 0.254: IC2.9 46.83,56.99 46.67,57.15 44.13,57.15 43.5,57.78 43.5,59.54 R5.1
  Top 0.813: R5.1 43.5,59.84 43.5,61.28 43.82,61.6 C9.2 Q3.2
N$2
  Top 0.254: IC2.16 48.83,47.7 C12.1
N$3
  Top 0.254: IC2.5 48.83,59.62 C13.1
N$4
  Top 0.254: IC2.12 46.83,51.59 46.29,51.05 43.75,51.05 43.35,50.65 R6.1
  Top 0.813: R6.1 43.5,49.38 43.5,47.62 43.82,47.3 C10.2 42.55,45.72 41.59,44.77 Q2.2
N$5
  Top 0.254: IC2.14 47.83,49.1 47.62,48.9 47.62,44.13 46.82,43.33 Q2.1
N$6  (via drill 0.6)
  Top 0.254: IC2.7 47.83,58.22 47.62,58.42 47.62,63.82 v47.31,64.14
  Top 0.813: v41.91,64.14 Q3.1
  Bottom 0.813: v47.31,64.14 v41.91,64.14
N$7
  Top 0.813: D3.C 39.16,37.47
  pour Top: 47.62,32.38 47.62,41.59 35.88,41.59 35.88,34.61 45.09,34.61 47.31,32.38
N$8
  Top 0.61: 45.87,68.41 46.04,68.58
  Top 0.813: L3.1 44.77,71.7
  pour Top: 46.67,66.99 35.88,66.99 35.88,75.25 46.67,75.25
N$10
  Top 0.254: IC2.10 43.6,54.73 R8.2
  Top 0.813: R8.2 41.06,54.83 R7.1
N$11
  Top 0.305: IC3.40 101.91,8.59 102.87,7.62 JP1.2 R13.1
N$12
  pour Top (isolate 0.406): 1.27,62.36 25.91,62.36 26.04,84.14 1.27,84.14
N$13
  Top 0.813: R4.2 3.17,28.57 4.45,29.84 IC1.5
N$14
  Top 0.813: IC1.3 13.97,32.38 14.92,33.34 14.92,38.1 C1.1
N$15
  Top 0.813: IC1.7 10.16,27.3 C5.1
N$16
  pour Top (isolate 0.305): 27.62,42.86 13.97,42.86 13.97,34.73 10.79,34.73 10.79,52.39 27.62,52.39
N$17
  Top 0.406: R3.1 D2.C Q1.3
N$18
  Top 0.813: R2.1 R1.2 7.62,27.94 8.26,28.57 IC1.6
N$19
  Top 0.406: R14.1 141.92,81.28 142.24,80.96 142.24,80.05 LED1.A
N$20
  Top 0.406: R15.1 137.48,84.14 139.38,86.04 146.05,86.04 147.15,84.94 LED2.A
N$21
  Top 0.406: R16.1 148.59,87 151.76,83.82 151.76,82.23 152.72,81.28 155.26,81.28 155.57,80.96 155.57,80.04 LED3.A
N$22
  Top 0.305: IC3.12 89.1,17.03 88.9,16.83 C15.2
N$23
  Top 0.305: IC3.37 100.41,5.79 98.74,4.13 89.22,4.13 85.72,7.62 JP2.2
N$24
  Top 0.305: IC3.38 100.91,5.02 99.38,3.49 87.95,3.49 86.36,5.08 JP2.3
PIC_CLKI
  Top 0.305: IC3.49 105.77,17.03 107.95,19.21 107.95,20.32 108.17,20.54 C21.1 113.12,20.54 XT1.2
PIC_CLKO
  Top 0.305: IC3.50 105.32,17.53 107.31,19.53 107.31,25.72 108.05,26.45 C20.1 113.12,26.45 XT1.1
PMALH
  Top 0.305: IC3.54 105.57,19.53 106.05,20 106.05,35.56 104.77,36.84 IC5.71
PMALL
  Top 0.305: IC3.53 106.03,19.03 106.68,19.68 106.68,35.88 105.27,37.29 IC5.72
PMD0
  Top 0.305: IC3.72 96.41,26.15 95.89,26.67 93.98,26.67 93.27,27.38 IC5.48
PMD1
  Top 0.305: IC3.69 97.91,28.14 95.25,30.8 95.25,37.15 95.77,37.67 IC5.53
PMD2
  Top 0.305: IC3.68 98.41,28.91 97.16,30.16 97.16,37.15 96.77,37.53 IC5.55
PMD3
  Top 0.305: IC3.67 98.91,29.53 97.77,30.66 IC5.57
PMD4
  Top 0.305: IC3.66 99.41,30.14 98.27,31.27 IC5.58
PMD5
  Top 0.305: IC3.65 99.91,30.91 98.77,32.04 IC5.59
PMD6
  Top 0.305: IC3.64 100.41,31.68 99.27,32.81 IC5.60
PMD7
  Top 0.305: IC3.63 100.91,31.65 101.12,31.87 101.12,37.31 100.77,37.66 IC5.63
PMRD
  Top 0.305: IC3.4 89.14,21.03 88.27,21.91 88.27,25.08 89.27,26.09 IC5.40
PMWR
  Top 0.305: IC3.3 89.59,21.53 88.9,22.23 88.9,24.77 89.77,25.64 IC5.41
SRAM_A0
  Top 0.305: IC5.32 85.01,42.46 83.5,40.96 65.41,40.96 63.5,42.86 63.5,87 65.86,89.35 IC6.3
SRAM_A1
  Top 0.305: IC6.4 66.33,88.55 64.14,86.36 64.14,43.18 65.72,41.59 83.19,41.59 84.56,42.96 IC5.31
SRAM_A2
  Top 0.305: IC5.30 84.1,43.46 82.87,42.23 66.04,42.23 64.77,43.5 64.77,85.72 66.8,87.75 IC6.5
SRAM_A3
  Top 0.305: IC6.6 67.27,86.95 65.41,85.09 65.41,45.72 66.67,44.45 66.69,44.46 IC5.28
SRAM_A4
  Top 0.305: IC5.25 83.58,45.96 83.19,46.35 66.67,46.35 66.04,46.99 66.04,84.45 67.73,86.15 IC6.7
SRAM_A5
  Top 0.305: IC5.2 84.78,57.46 84.45,57.78 84.45,77.47 85.94,78.95 IC6.16
SRAM_A6
  Top 0.305: IC6.17 87.04,78.15 85.72,76.83 85.72,58.01 IC5.1
SRAM_A7
  Top 0.305: IC5.144 87.77,70.34 87,71.12 87,76.2 88.14,77.35 IC6.18
SRAM_A8
  Top 0.305: IC6.19 88.61,76.55 87.63,75.56 87.63,71.44 88.27,70.8 IC5.143
SRAM_A9
  Top 0.305: IC6.20 89.08,75.75 88.27,74.93 88.27,71.75 88.77,71.25 IC5.142
SRAM_A10
  Top 0.305: IC6.26 102.52,76.55 102.87,76.2 102.87,72.39 101.12,70.64 101.12,61.75 100.77,61.4 IC5.118
SRAM_A11
  Top 0.305: IC5.121 99.27,60.85 100.49,62.07 100.49,71.28 100.33,71.44 100.33,76.99 100.69,77.35 IC6.27
SRAM_A12
  Top 0.305: IC5.122 98.77,61.15 99.85,62.23 99.85,70.96 99.69,71.12 99.69,77.63 100.22,78.15 IC6.28
SRAM_A13
  Top 0.254: IC5.125 97.27,61.23 97.63,61.59 | 97.63,61.59 | 97.63,61.59 97.95,61.91 97.95,74.14
  Top 0.305: 97.95,74.14 99.06,75.25 99.06,78.42 99.59,78.95 IC6.29
SRAM_A14
  Top 0.254: IC5.126 96.77,61.53 97.47,62.23 97.47,74.77
  Top 0.305: 97.47,74.77 97.71,75.01 98.42,75.72 98.42,79.06 99.12,79.75 IC6.30
SRAM_A15
  Top 0.305: IC6.38 95.67,86.15 94.61,85.09 94.61,78.42 93.34,77.15 93.34,72.71 91.77,71.13 IC5.136
SRAM_A16
  Top 0.305: IC6.39 95.2,86.95 93.98,85.72 93.98,78.74 92.71,77.47 92.71,73.03 91.27,71.58 IC5.137
SRAM_A17
  Top 0.305: IC6.40 95.05,87.75 93.34,86.04 93.34,79.06 92.08,77.79 92.08,73.34 90.27,71.54 IC5.139
SRAM_A18
  Top 0.305: IC6.41 94.9,88.55 92.71,86.36 92.71,79.38 91.44,78.11 91.44,73.66 89.27,71.49 IC5.141
SRAM_CE
  Top 0.305: IC5.24 84.03,46.46 83.5,46.99 67.31,46.99 66.67,47.62 66.67,83.82 68.2,85.35 IC6.8
SRAM_D0
  Top 0.305: IC5.9 78.73,53.96 77.15,52.39 68.26,52.39 67.31,53.34 67.31,83.19 68.67,84.55 IC6.9
SRAM_D1
  Top 0.305: IC6.10 69.14,83.75 67.94,82.55 67.94,53.66 68.58,53.02 76.83,53.02 78.28,54.46 IC5.8
SRAM_D2
  Top 0.305: IC5.7 77.82,54.96 76.52,53.66 68.9,53.66 68.58,53.98 68.58,80.64 69.28,81.35 IC6.13
SRAM_D3
  Top 0.305: IC5.4 83.87,56.46 82.55,57.78 82.55,78.11 85,80.55 IC6.14
SRAM_D4
  Top 0.305: IC5.129 95.27,61.93 95.57,62.23 95.57,70.17 96.52,71.12 96.52,74.93 97.79,76.2 97.79,80.01 98.33,80.55 IC6.31
SRAM_D5
  Top 0.305: IC6.32 97.86,81.35 97.16,80.64 97.16,76.52 95.89,75.25 95.89,71.44 93.77,69.32 IC5.132
SRAM_D6
  Top 0.305: IC6.35 97.08,83.75 96.52,83.19 96.52,76.83 95.25,75.56 95.25,71.75 93.27,69.78 IC5.133
SRAM_D7
  Top 0.305: IC6.36 96.61,84.55 95.89,83.82 95.89,77.47 94.61,76.2 94.61,72.07 92.77,70.23 IC5.134
SRAM_OE
  Top 0.305: IC6.37 96.14,85.35 95.25,84.45 95.25,78.11 93.98,76.83 93.98,72.39 92.27,70.68 IC5.135
SRAM_WE
  Top 0.305: IC5.3 84.33,56.96 83.5,57.78 83.5,77.79 85.47,79.75 IC6.15
TCK
  Top 0.305: IC5.12 82.31,52.46 81.92,52.07 TCK.TP
TDI
  Top 0.305: IC5.13 84.35,51.96 TDI.TP
TDO
  Top 0.305: IC5.10 79.5,53.46 78.11,52.07 TDO.TP
TMS
  Top 0.305: IC5.11 80.9,52.96 80.01,52.07 TMS.TP
USBD+
  Top 0.305: CN2.3 13.51,14.14 13.97,14.6 IC4.4 24.1,15.24 29.84,15.24 30.05,15.03 IC3.16
  Top 0.406: IC4.4 23.49,14.6
USBD-
  Top 0.305: CN2.2 23.44,12.68 | 23.49,12.7 24.13,12.06 27.94,12.06 30.41,14.53 IC3.17
  Top 0.406: 23.44,12.68 IC4.6 23.49,12.7
USBDETECT
  Top 0.305: IC3.18 78.8,14.03 74.93,10.16 73.66,10.16 | 73.66,10.16 15.53,10.16 CN2.1 | R10.2 73.03,12.06 73.66,11.43 73.66,10.16

## Text on the board
Top: DiscFerret Analyser Rev 0J28 | (C) 2010 P A Pemberton | TCU | http://www.discferret.com
Bottom: BCU
tPlace: 1 | + | + | 3V3 | MCU | FPGA | K | + | 1 | 1 | K | K | + | 1 | DiscFerret Analyser Rev 0J28 | (C) 2010 P A Pemberton | TOV | http://www.discferret.com | GND | TX | PCB S/N | RX | BOOT
bPlace: BOV
tNames: JTAG
tDocu: +12V | +5V | +3V3 | GND | +1V2